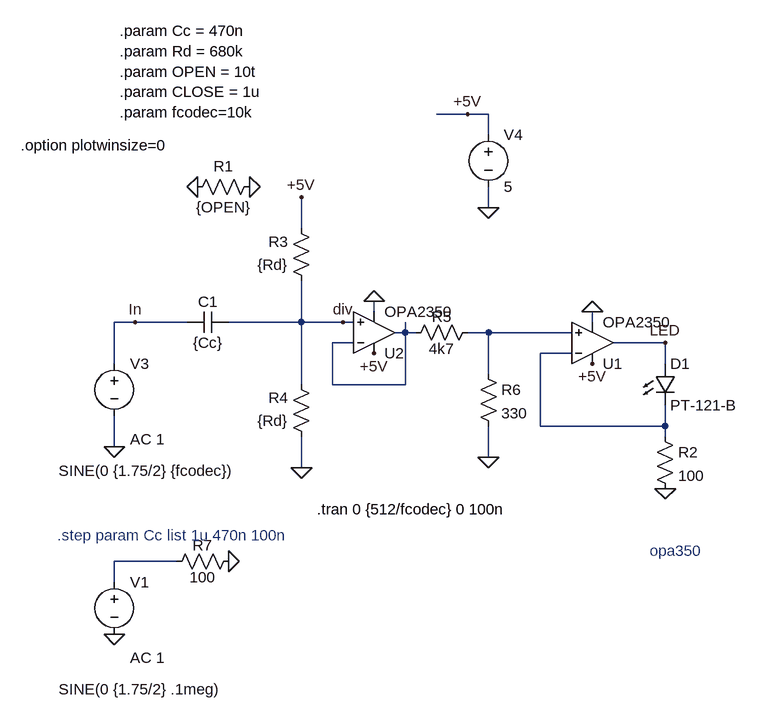
[diagram p0: schematic ALDO_LED_Driver_ac.asc]
ALDO_LED_Driver_ac.asc, the LTspice schematic file:
Version 4
SHEET 1 920 1220
WIRE -544 -96 -592 -96
WIRE -512 -96 -544 -96
WIRE -512 -64 -512 -96
WIRE -512 48 -512 16
WIRE -800 80 -800 32
WIRE -688 208 -688 192
WIRE -1056 224 -1088 224
WIRE -976 224 -1056 224
WIRE -800 224 -800 160
WIRE -800 224 -912 224
WIRE -736 224 -800 224
WIRE -720 224 -736 224
WIRE -352 224 -352 208
WIRE -640 240 -640 224
WIRE -640 240 -656 240
WIRE -624 240 -640 240
WIRE -512 240 -544 240
WIRE -384 240 -512 240
WIRE -720 256 -752 256
WIRE -240 256 -320 256
WIRE -384 272 -432 272
WIRE -1088 288 -1088 224
WIRE -240 288 -240 256
WIRE -512 304 -512 240
WIRE -800 320 -800 224
WIRE -752 320 -752 256
WIRE -640 320 -640 240
WIRE -640 320 -752 320
WIRE -432 384 -432 272
WIRE -240 384 -240 352
WIRE -240 384 -432 384
WIRE -240 400 -240 384
WIRE -1088 416 -1088 368
WIRE -512 432 -512 384
WIRE -800 448 -800 400
WIRE -992 592 -1088 592
WIRE -1088 624 -1088 592
FLAG -512 48 0
FLAG -1088 416 0
FLAG -1056 224 In
FLAG -240 480 0
FLAG -800 448 0
FLAG -240 256 LED
FLAG -800 32 +5V
FLAG -544 -96 +5V
FLAG -352 288 +5V
FLAG -352 208 0
FLAG -736 224 div
FLAG -512 432 0
FLAG -688 272 +5V
FLAG -688 192 0
FLAG -960 16 0
FLAG -880 16 0
FLAG -1088 704 0
FLAG -912 592 0
SYMBOL voltage -1088 272 R0
WINDOW 123 24 132 Left 2
WINDOW 39 0 0 Left 2
WINDOW 3 -86 181 Left 2
SYMATTR Value2 AC 1
SYMATTR InstName V3
SYMATTR Value SINE(0 {1.75/2} {fcodec})
SYMBOL voltage -512 -80 R0
WINDOW 123 0 0 Left 2
WINDOW 39 24 44 Left 2
SYMATTR InstName V4
SYMATTR Value 5
SYMBOL res -784 176 R180
WINDOW 0 36 76 Left 2
WINDOW 3 36 40 Left 2
SYMATTR InstName R3
SYMATTR Value {Rd}
SYMBOL res -784 416 R180
WINDOW 0 36 76 Left 2
WINDOW 3 36 40 Left 2
SYMATTR InstName R4
SYMATTR Value {Rd}
SYMBOL LED -256 288 R0
SYMATTR InstName D1
SYMATTR Value PT-121-B
SYMBOL res -256 384 R0
SYMATTR InstName R2
SYMATTR Value 100
SYMBOL cap -912 208 R90
WINDOW 0 0 32 VBottom 2
WINDOW 3 32 32 VTop 2
SYMATTR InstName C1
SYMATTR Value {Cc}
SYMBOL res -976 32 R270
WINDOW 0 32 56 VTop 2
WINDOW 3 0 56 VBottom 2
SYMATTR InstName R1
SYMATTR Value {OPEN}
SYMBOL MDB_sym\\OPA2350 -352 256 M180
WINDOW 38 67 68 Center 2
SYMATTR InstName U1
SYMBOL res -640 256 R270
WINDOW 0 25 56 VTop 2
WINDOW 3 7 56 VBottom 2
SYMATTR InstName R5
SYMATTR Value 4k7
SYMBOL res -528 288 R0
SYMATTR InstName R6
SYMATTR Value 330
SYMBOL MDB_sym\\OPA2350 -688 240 M180
SYMATTR InstName U2
SYMBOL voltage -1088 608 R0
WINDOW 123 24 132 Left 2
WINDOW 39 0 0 Left 2
WINDOW 3 -86 181 Left 2
SYMATTR Value2 AC 1
SYMATTR InstName V1
SYMATTR Value SINE(0 {1.75/2} .1meg)
SYMBOL res -896 576 R90
WINDOW 0 7 56 VBottom 2
WINDOW 3 25 56 VTop 2
SYMATTR InstName R7
SYMATTR Value 100
TEXT -776 512 Left 2 !.tran 0 {512/fcodec} 0 100n
TEXT -1080 -224 Left 2 !.param Cc = 470n\n.param Rd = 680k\n.param OPEN = 10t\n.param CLOSE = 1u\n.param fcodec=10k
TEXT -264 576 Left 2 ;opa350
TEXT -1176 552 Left 2 ;.step param Cc list 1u 470n 100n
TEXT -1232 -48 Left 2 !.option plotwinsize=0

The netlist it stands for:
* ALDO_LED_Driver_ac.asc
V3 In 0 SINE(0 {1.75/2} {fcodec}) AC 1
V4 +5V 0 5
R3 div +5V {Rd}
R4 0 div {Rd}
D1 LED N003 PT-121-B
R2 N003 0 100
C1 div In {Cc}
R1 0 0 {OPEN}
* U1: OPA2350 (symbol MDB_sym\OPA2350 not available, pins judged from their places): In+=N002 In-=N003 V+=+5V V-=0 OUT=LED
R5 N001 N002 4k7
R6 N002 0 330
* U2: OPA2350 (symbol MDB_sym\OPA2350 not available, pins judged from their places): In+=div In-=N001 V+=+5V V-=0 OUT=N001
V1 N004 0 SINE(0 {1.75/2} .1meg) AC 1
R7 0 N004 100
.model D D
.lib standard.dio
.tran 0 {512/fcodec} 0 100n
.param Cc = 470n
.param Rd = 680k
.param OPEN = 10t
.param CLOSE = 1u
.param fcodec=10k
* opa350
* .step param Cc list 1u 470n 100n
.option plotwinsize=0
.backanno
.end